# Altium schematic sheet cpu.SchDoc: CPU and Power Supply
size A3; Author: Daniele Basile <asterix24@gmail.com>; Organization: Develer s.r.l.; Address3: Firenze; Address4: ITALY; SheetNumber: 1; SheetTotal: 1
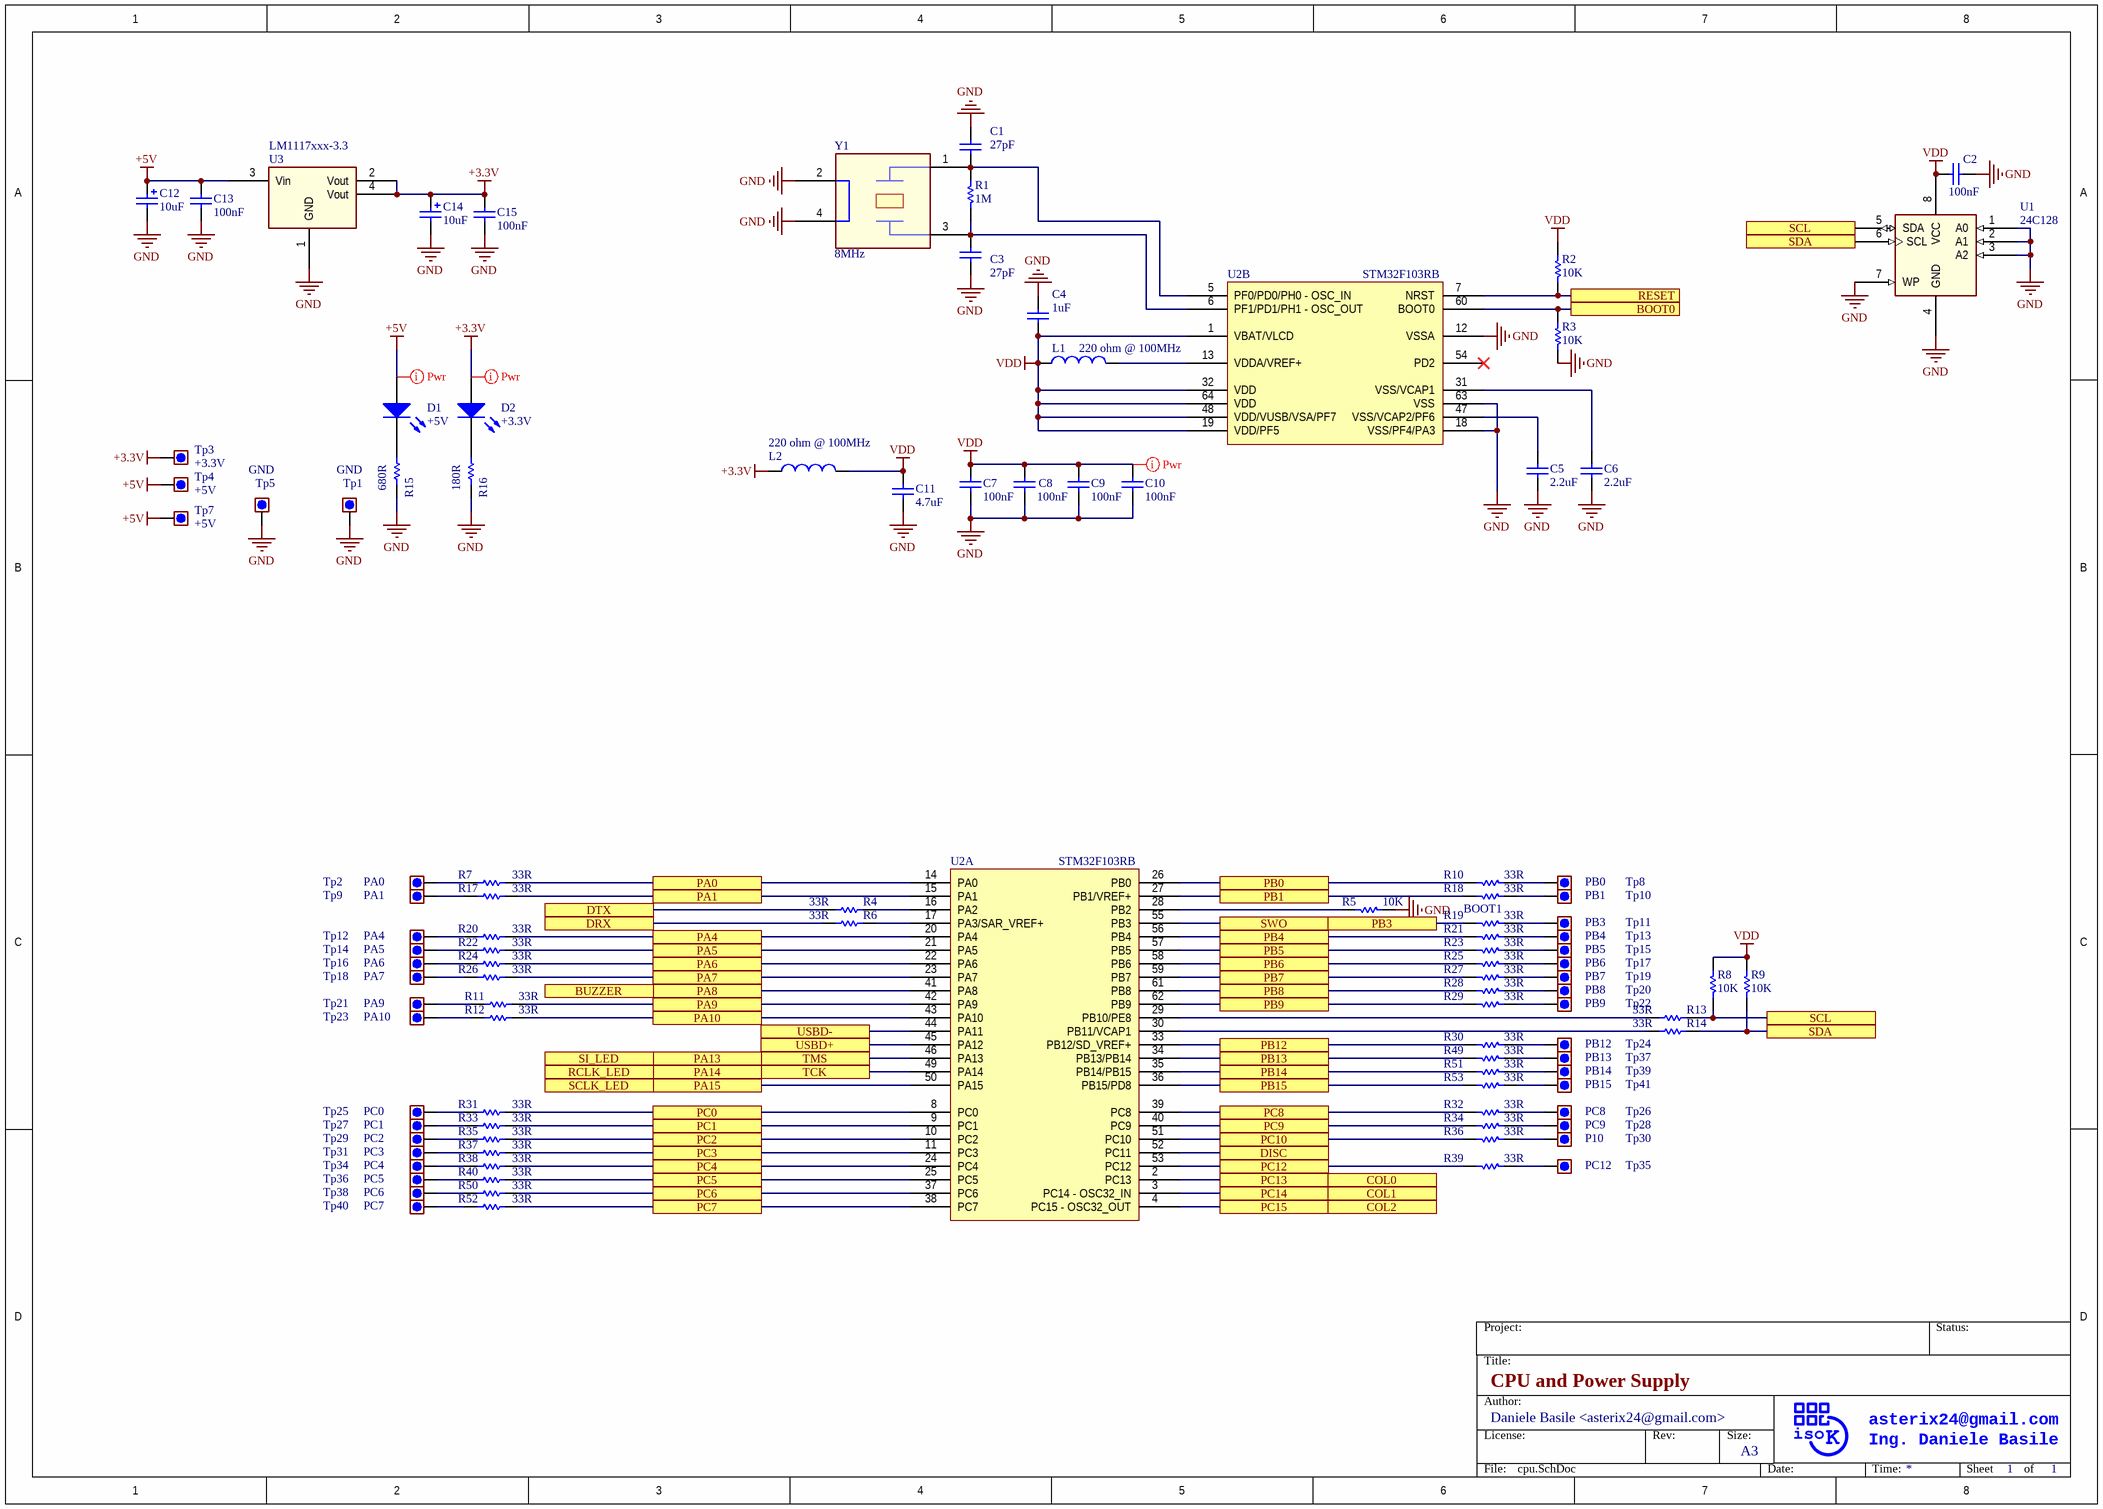
[diagram p0: cpu.SchDoc]

## Parts
C1  27pF  [0603_[1608]]
C2  100nF  [0603_[1608]]
C3  27pF  [0603_[1608]]
C4  1uF  [0603_[1608]]
C5  2.2uF  [0603_[1608]]
C6  2.2uF  [0603_[1608]]
C7  100nF  [0603_[1608]]
C8  100nF  [0603_[1608]]
C9  100nF  [0603_[1608]]
C10  100nF  [0603_[1608]]
C11  4.7uF  [0603_[1608]]
C12  10uF  [1206_[3216]]
C13  100nF  [0603_[1608]]
C14  10uF  [1206_[3216]]
C15  100nF  [0603_[1608]]
D1  +5V  [0603_[1608]_K2-A1_LED]
D2  +3.3V  [0603_[1608]_K2-A1_LED]
L1  220 ohm @ 100MHz  [0805_[2012]]
L2  220 ohm @ 100MHz  [0805_[2012]]
R1  1M  [0603_[1608]]
R2  10K  [0603_[1608]]
R3  10K  [0603_[1608]]
R4  33R  [0603_[1608]]
R5  10K  [0603_[1608]]
R6  33R  [0603_[1608]]
R7  33R  [0603_[1608]]
R8  10K  [0603_[1608]]
R9  10K  [0603_[1608]]
R10  33R  [0603_[1608]]
R11  33R  [0603_[1608]]
R12  33R  [0603_[1608]]
R13  33R  [0603_[1608]]
R14  33R  [0603_[1608]]
R15  680R  [0603_[1608]]
R16  180R  [0603_[1608]]
R17  33R  [0603_[1608]]
R18  33R  [0603_[1608]]
R19  33R  [0603_[1608]]
R20  33R  [0603_[1608]]
R21  33R  [0603_[1608]]
R22  33R  [0603_[1608]]
R23  33R  [0603_[1608]]
R24  33R  [0603_[1608]]
R25  33R  [0603_[1608]]
R26  33R  [0603_[1608]]
R27  33R  [0603_[1608]]
R28  33R  [0603_[1608]]
R29  33R  [0603_[1608]]
R30  33R  [0603_[1608]]
R31  33R  [0603_[1608]]
R32  33R  [0603_[1608]]
R33  33R  [0603_[1608]]
R34  33R  [0603_[1608]]
R35  33R  [0603_[1608]]
R36  33R  [0603_[1608]]
R37  33R  [0603_[1608]]
R38  33R  [0603_[1608]]
R39  33R  [0603_[1608]]
R40  33R  [0603_[1608]]
R49  33R  [0603_[1608]]
R50  33R  [0603_[1608]]
R51  33R  [0603_[1608]]
R52  33R  [0603_[1608]]
R53  33R  [0603_[1608]]
Tp1  GND  [TEST_POINT_THD_D1.8MM]  (no BOM)
Tp2  PA0  [TEST_POINT_THD_D1.8MM]  (no BOM)
Tp3  +3.3V  [TEST_POINT_THD_D1.8MM]  (no BOM)
Tp4  +5V  [TEST_POINT_THD_D1.6MM_OVAL]  (no BOM)
Tp5  GND  [TEST_POINT_THD_D1.8MM]  (no BOM)
Tp7  +5V  [TEST_POINT_THD_D1.8MM]  (no BOM)
Tp8  PB0  [TEST_POINT_THD_D1.8MM]  (no BOM)
Tp9  PA1  [TEST_POINT_THD_D1.8MM]  (no BOM)
Tp10  PB1  [TEST_POINT_THD_D1.8MM]  (no BOM)
Tp11  PB3  [TEST_POINT_THD_D1.8MM]  (no BOM)
Tp12  PA4  [TEST_POINT_THD_D1.8MM]  (no BOM)
Tp13  PB4  [TEST_POINT_THD_D1.8MM]  (no BOM)
Tp14  PA5  [TEST_POINT_THD_D1.8MM]  (no BOM)
Tp15  PB5  [TEST_POINT_THD_D1.8MM]  (no BOM)
Tp16  PA6  [TEST_POINT_THD_D1.8MM]  (no BOM)
Tp17  PB6  [TEST_POINT_THD_D1.8MM]  (no BOM)
Tp18  PA7  [TEST_POINT_THD_D1.8MM]  (no BOM)
Tp19  PB7  [TEST_POINT_THD_D1.8MM]  (no BOM)
Tp20  PB8  [TEST_POINT_THD_D1.8MM]  (no BOM)
Tp21  PA9  [TEST_POINT_THD_D1.8MM]  (no BOM)
Tp22  PB9  [TEST_POINT_THD_D1.8MM]  (no BOM)
Tp23  PA10  [TEST_POINT_THD_D1.8MM]  (no BOM)
Tp24  PB12  [TEST_POINT_THD_D1.8MM]  (no BOM)
Tp25  PC0  [TEST_POINT_THD_D1.8MM]  (no BOM)
Tp26  PC8  [TEST_POINT_THD_D1.8MM]  (no BOM)
Tp27  PC1  [TEST_POINT_THD_D1.8MM]  (no BOM)
Tp28  PC9  [TEST_POINT_THD_D1.8MM]  (no BOM)
Tp29  PC2  [TEST_POINT_THD_D1.8MM]  (no BOM)
Tp30  P10  [TEST_POINT_THD_D1.8MM]  (no BOM)
Tp31  PC3  [TEST_POINT_THD_D1.8MM]  (no BOM)
Tp34  PC4  [TEST_POINT_THD_D1.8MM]  (no BOM)
Tp35  PC12  [TEST_POINT_THD_D1.8MM]  (no BOM)
Tp36  PC5  [TEST_POINT_THD_D1.8MM]  (no BOM)
Tp37  PB13  [TEST_POINT_THD_D1.8MM]  (no BOM)
Tp38  PC6  [TEST_POINT_THD_D1.8MM]  (no BOM)
Tp39  PB14  [TEST_POINT_THD_D1.8MM]  (no BOM)
Tp40  PC7  [TEST_POINT_THD_D1.8MM]  (no BOM)
Tp41  PB15  [TEST_POINT_THD_D1.8MM]  (no BOM)
U1  24C128  [SOIC8]
U2  STM32F103RB  [TSQFP50P1200X1200X160-64N]  (parts A,B of 2)
U3  LM1117xxx-3.3  [SOT-223]
Y1  8MHz  [CRYSTAL_3.2X2.5MM_4P_SMD]

## Ports
BOOT0, BUZZER, COL0, COL1, COL2, DISC, DRX, DTX, PA0, PA1, PA4, PA5, PA6, PA7, PA8, PA9, PA10, PA13, PA14, PA15, PB0, PB1, PB3, PB4, PB5, PB6, PB7, PB8, PB9, PB12, PB13, PB14, PB15, PC0, PC1, PC2, PC3, PC4, PC5, PC6, PC7, PC8, PC9, PC10, PC12, PC13, PC14, PC15, RCLK_LED, RESET, SCL, SCLK_LED, SDA, SI_LED, SWO, TCK, TMS, USBD+, USBD-

## Nets
+3.3V: C14.1 C15.2 D2.1(A) L2.1 Tp3.1 U3.2(Vout) U3.4(Vout)
+5V: C12.1 C13.2 D1.1(A) Tp4.1 Tp7.1 U3.3(Vin)
GND: C1.2 C2.1 C3.2 C4.2 C5.1 C6.1 C7.2 C8.2 C9.2 C10.2 C11.1 C12.2 C13.1 C14.2 C15.1 R3.1 R5.2 R15.1 R16.1 Tp1.1 Tp5.1 U1.1(A0) U1.2(A1) U1.3(A2) U1.4(GND) U1.7(WP) U2.12(VSSA) U2.18(VSS/PF4/PA3) U2.63(VSS) U3.1(GND) Y1.2 Y1.4
VDD: C2.2 C4.1 C7.1 C8.1 C9.1 C10.1 C11.2 L1.1 L2.2 R2.1 R8.2 R9.2 U1.8(VCC) U2.1(VBAT/VLCD) U2.19(VDD/PF5) U2.32(VDD) U2.48(VDD/VUSB/VSA/PF7) U2.64(VDD)
BOOT0: R3.2 U2.60(BOOT0) ; port BOOT0
BUZZER: U2.41(PA8) ; port PA8, port BUZZER
COL0: U2.2(PC13) ; port PC13, port COL0
COL1: U2.3(PC14_-_OSC32_IN) ; port PC14, port COL1
COL2: U2.4(PC15_-_OSC32_OUT) ; port PC15, port COL2
DISC: U2.52(PC11) ; port DISC
DRX: R6.2 ; port DRX
DTX: R4.2 ; port DTX
PA0: R7.1 U2.14(PA0) ; port PA0
PA1: R17.1 U2.15(PA1) ; port PA1
PA4: R20.1 U2.20(PA4) ; port PA4
PA5: R22.1 U2.21(PA5) ; port PA5
PA6: R24.1 U2.22(PA6) ; port PA6
PA7: R26.1 U2.23(PA7) ; port PA7
PA9: R11.1 U2.42(PA9) ; port PA9
PA10: R12.1 U2.43(PA10) ; port PA10
PA13: U2.46(PA13) ; port TMS, port PA13, port SI_LED
PA14: U2.49(PA14) ; port TCK, port PA14, port RCLK_LED
PA15: U2.50(PA15) ; port PA15, port SCLK_LED
PB0: R10.1 U2.26(PB0) ; port PB0
PB1: R18.1 U2.27(PB1/VREF+) ; port PB1
PB3: R19.1 U2.55(PB3) ; port SWO, port PB3
PB4: R21.1 U2.56(PB4) ; port PB4
PB5: R23.1 U2.57(PB5) ; port PB5
PB6: R25.1 U2.58(PB6) ; port PB6
PB7: R27.1 U2.59(PB7) ; port PB7
PB8: R28.1 U2.61(PB8) ; port PB8
PB9: R29.1 U2.62(PB9) ; port PB9
PB12: R30.1 U2.33(PB12/SD_VREF+) ; port PB12
PB13: R49.1 U2.34(PB13/PB14) ; port PB13
PB14: R51.1 U2.35(PB14/PB15) ; port PB14
PB15: R53.1 U2.36(PB15/PD8) ; port PB15
PC0: R31.1 U2.8(PC0) ; port PC0
PC1: R33.1 U2.9(PC1) ; port PC1
PC2: R35.1 U2.10(PC2) ; port PC2
PC3: R37.1 U2.11(PC3) ; port PC3
PC4: R38.1 U2.24(PC4) ; port PC4
PC5: R40.1 U2.25(PC5) ; port PC5
PC6: R50.1 U2.37(PC6) ; port PC6
PC7: R52.1 U2.38(PC7) ; port PC7
PC8: R32.1 U2.39(PC8) ; port PC8
PC9: R34.1 U2.40(PC9) ; port PC9
PC10: R36.1 U2.51(PC10) ; port PC10
PC12: R39.1 U2.53(PC12) ; port PC12
RESET: R2.2 U2.7(NRST) ; port RESET
SCL: R8.1 R13.1 U1.5(SDA) ; port SCL
SDA: R9.1 R14.1 U1.6(SCL) ; port SDA
USBD+: U2.45(PA12) ; port USBD+
USBD-: U2.44(PA11) ; port USBD-
NetC1_1: C1.1 R1.2 U2.5(PF0/PD0/PH0_-_OSC_IN) Y1.1
NetC3_1: C3.1 R1.1 U2.6(PF1/PD1/PH1_-_OSC_OUT) Y1.3
NetC5_2: C5.2 U2.47(VSS/VCAP2/PF6)
NetC6_2: C6.2 U2.31(VSS/VCAP1)
NetD1_2: D1.2(K) R15.2
NetD2_2: D2.2(K) R16.2
NetL1_2: L1.2 U2.13(VDDA/VREF+)
NetR4_1: R4.1 U2.16(PA2)
NetR5_1: R5.1 U2.28(PB2)
NetR6_1: R6.1 U2.17(PA3/SAR_VREF+)
NetR7_2: R7.2 Tp2.1
NetR10_2: R10.2 Tp8.1
NetR11_2: R11.2 Tp21.1
NetR12_2: R12.2 Tp23.1
NetR13_2: R13.2 U2.29(PB10/PE8)
NetR14_2: R14.2 U2.30(PB11/VCAP1)
NetR17_2: R17.2 Tp9.1
NetR18_2: R18.2 Tp10.1
NetR19_2: R19.2 Tp11.1
NetR20_2: R20.2 Tp12.1
NetR21_2: R21.2 Tp13.1
NetR22_2: R22.2 Tp14.1
NetR23_2: R23.2 Tp15.1
NetR24_2: R24.2 Tp16.1
NetR25_2: R25.2 Tp17.1
NetR26_2: R26.2 Tp18.1
NetR27_2: R27.2 Tp19.1
NetR28_2: R28.2 Tp20.1
NetR29_2: R29.2 Tp22.1
NetR30_2: R30.2 Tp24.1
NetR31_2: R31.2 Tp25.1
NetR32_2: R32.2 Tp26.1
NetR33_2: R33.2 Tp27.1
NetR34_2: R34.2 Tp28.1
NetR35_2: R35.2 Tp29.1
NetR36_2: R36.2 Tp30.1
NetR37_2: R37.2 Tp31.1
NetR38_2: R38.2 Tp34.1
NetR39_2: R39.2 Tp35.1
NetR40_2: R40.2 Tp36.1
NetR49_2: R49.2 Tp37.1
NetR50_2: R50.2 Tp38.1
NetR51_2: R51.2 Tp39.1
NetR52_2: R52.2 Tp40.1
NetR53_2: R53.2 Tp41.1

Not connected (* = marked no-connect by the designer): U2 54(PD2)*

## Layout directives
net class Power: +3.3V, +5V, VDD

## Notes on the sheet
- BOOT1
- Title:
- Project:
- Status:
- Author:
- License:
- Rev:
- Size:
- A3
- asterix24@gmail.com
- Ing. Daniele Basile
- File:
- Date:
- Time:
- Sheet
- of

## Library data of the parts
C1 C3 = Cap: Ceramic NP0 +/- 0.1; Value: 10nF; Published: 8-Jun-2000; Revision: July-2002: Re-released for DXP Platform.; Publisher: Altium Limited
C2 C7-C10 = Cap: Ceramic X7R 50V; Value: 10nF; Published: 8-Jun-2000; Revision: July-2002: Re-released for DXP Platform.; Publisher: Altium Limited
C4 C11 = Cap: Ceramic X7R 16V; Value: 10nF; Published: 8-Jun-2000; Revision: July-2002: Re-released for DXP Platform.; Publisher: Altium Limited
C5 C6 = Cap: Ceramic 6.3V X7R; Value: 10nF; Published: 8-Jun-2000; Revision: July-2002: Re-released for DXP Platform.; Publisher: Altium Limited
C12 C14 = Cap Pol1: Ceramic X5R 25V; Published: 8-Jun-2000; Revision: July-2002: Re-released for DXP Platform.; Publisher: Altium Limited; Value: 10uF
C13 C15 = Cap: Ceramic X7R 50V; Value: 100pF; Published: 8-Jun-2000; LatestRevisionDate: 17-Jul-2002; LatestRevisionNote: Re-released for DXP Platform.; PackageReference: RAD-0.3; Publisher: Altium Limited; PackageDescription: Radial Cap, Thru-Hole; 2 Leads; 0.3 in Pin Spacing
D1 D2 = LED0: LED Green; Published: 8-Jun-2000; LatestRevisionDate: 08-Jul-2005; LatestRevisionNote: Mech Layer 1 removed.; PackageReference: LED-0; Publisher: Altium Limited; PackageDescription: LED; 2 Leads
L1 = Inductor: Value: 100uH; Published: 8-Jun-2000; Revision: July-2002: Re-released for DXP Platform.; Publisher: Altium Limited
L2 = Inductor: WE 742792022
R1-R14 R17-R40 R49-R53 = Res1: Resistor; Value: 1K; Published: 8-Jun-2000; Revision: July-2002: Re-released for DXP Platform.; Publisher: Altium Limited
R15 R16 = Res1: Resistor; Revision: July-2002: Re-released for DXP Platform.
Tp1-Tp5 Tp7-Tp31 Tp34-Tp41 = Test_point: Test point
U1 = EEPROM-SOIC8: EEPROM
U3 = LM1117-FIXED-OUT: LM1117 LDO Fixed output
Y1 = CRYSTAL-4p